# EAGLE board tester (EAGLE 9.6.2), part 1 of 2
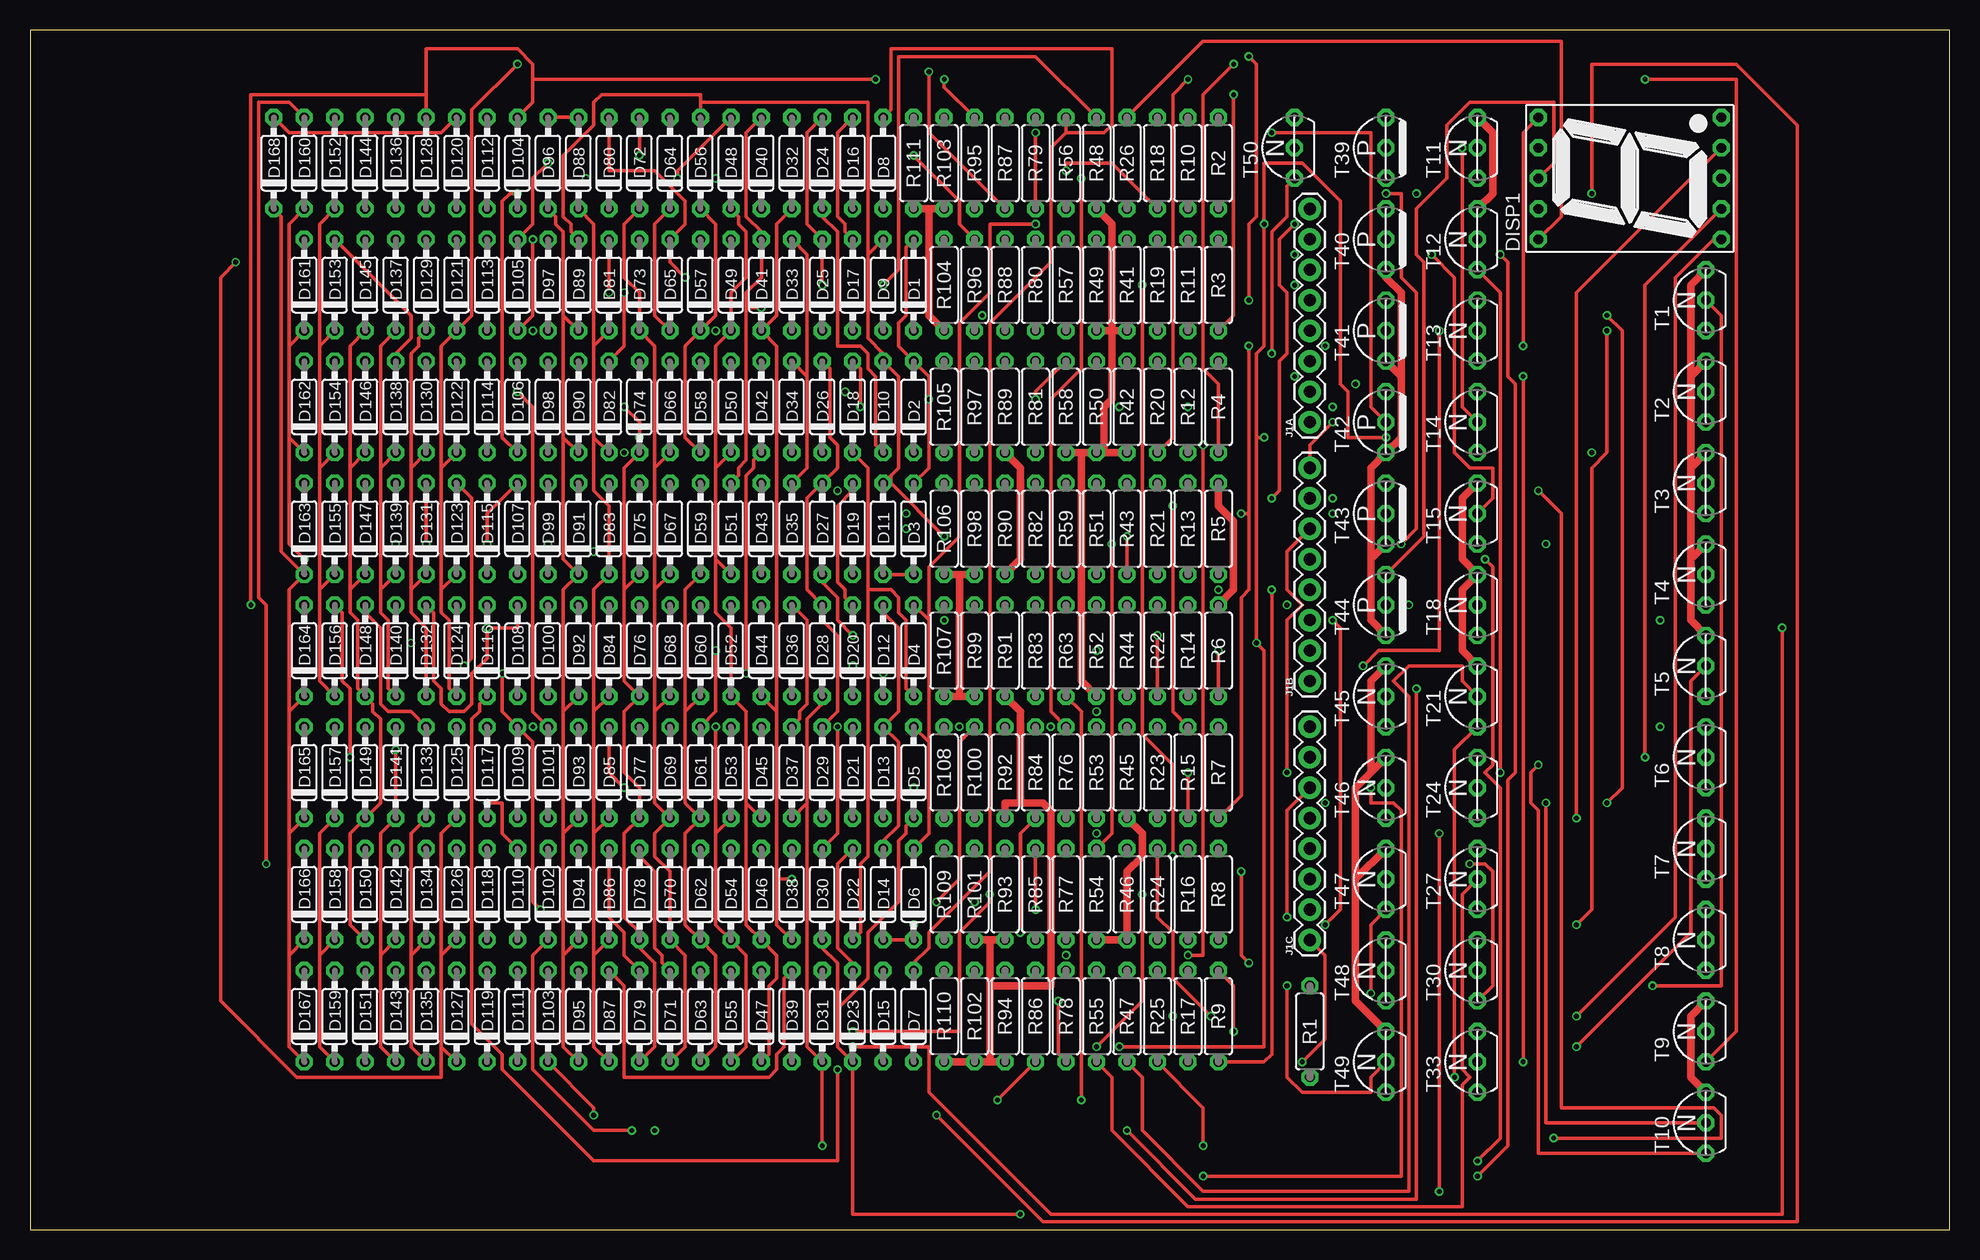
[diagram p1: board, top side]
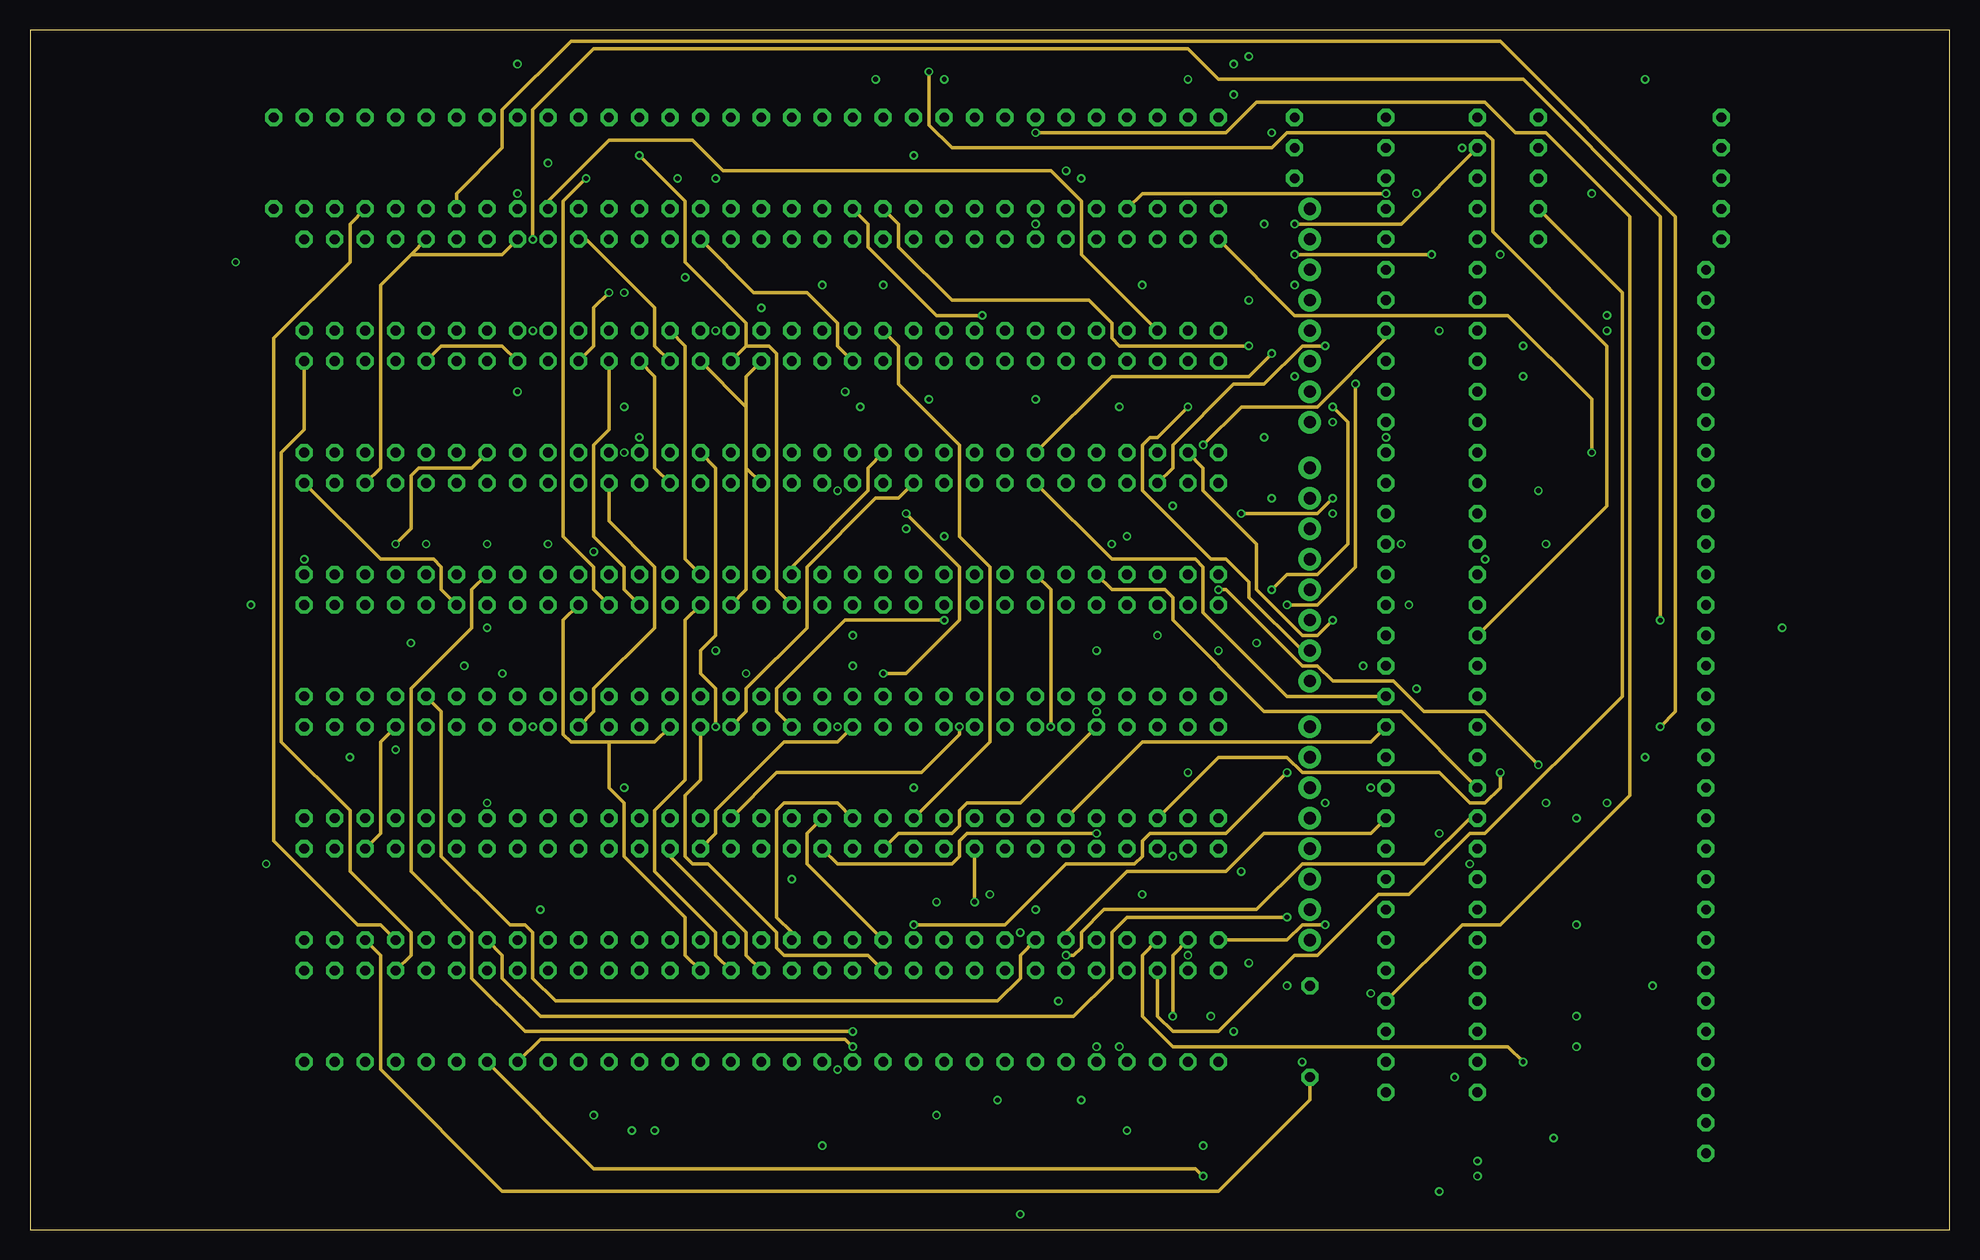
[diagram p2: board, inner layer Route2]
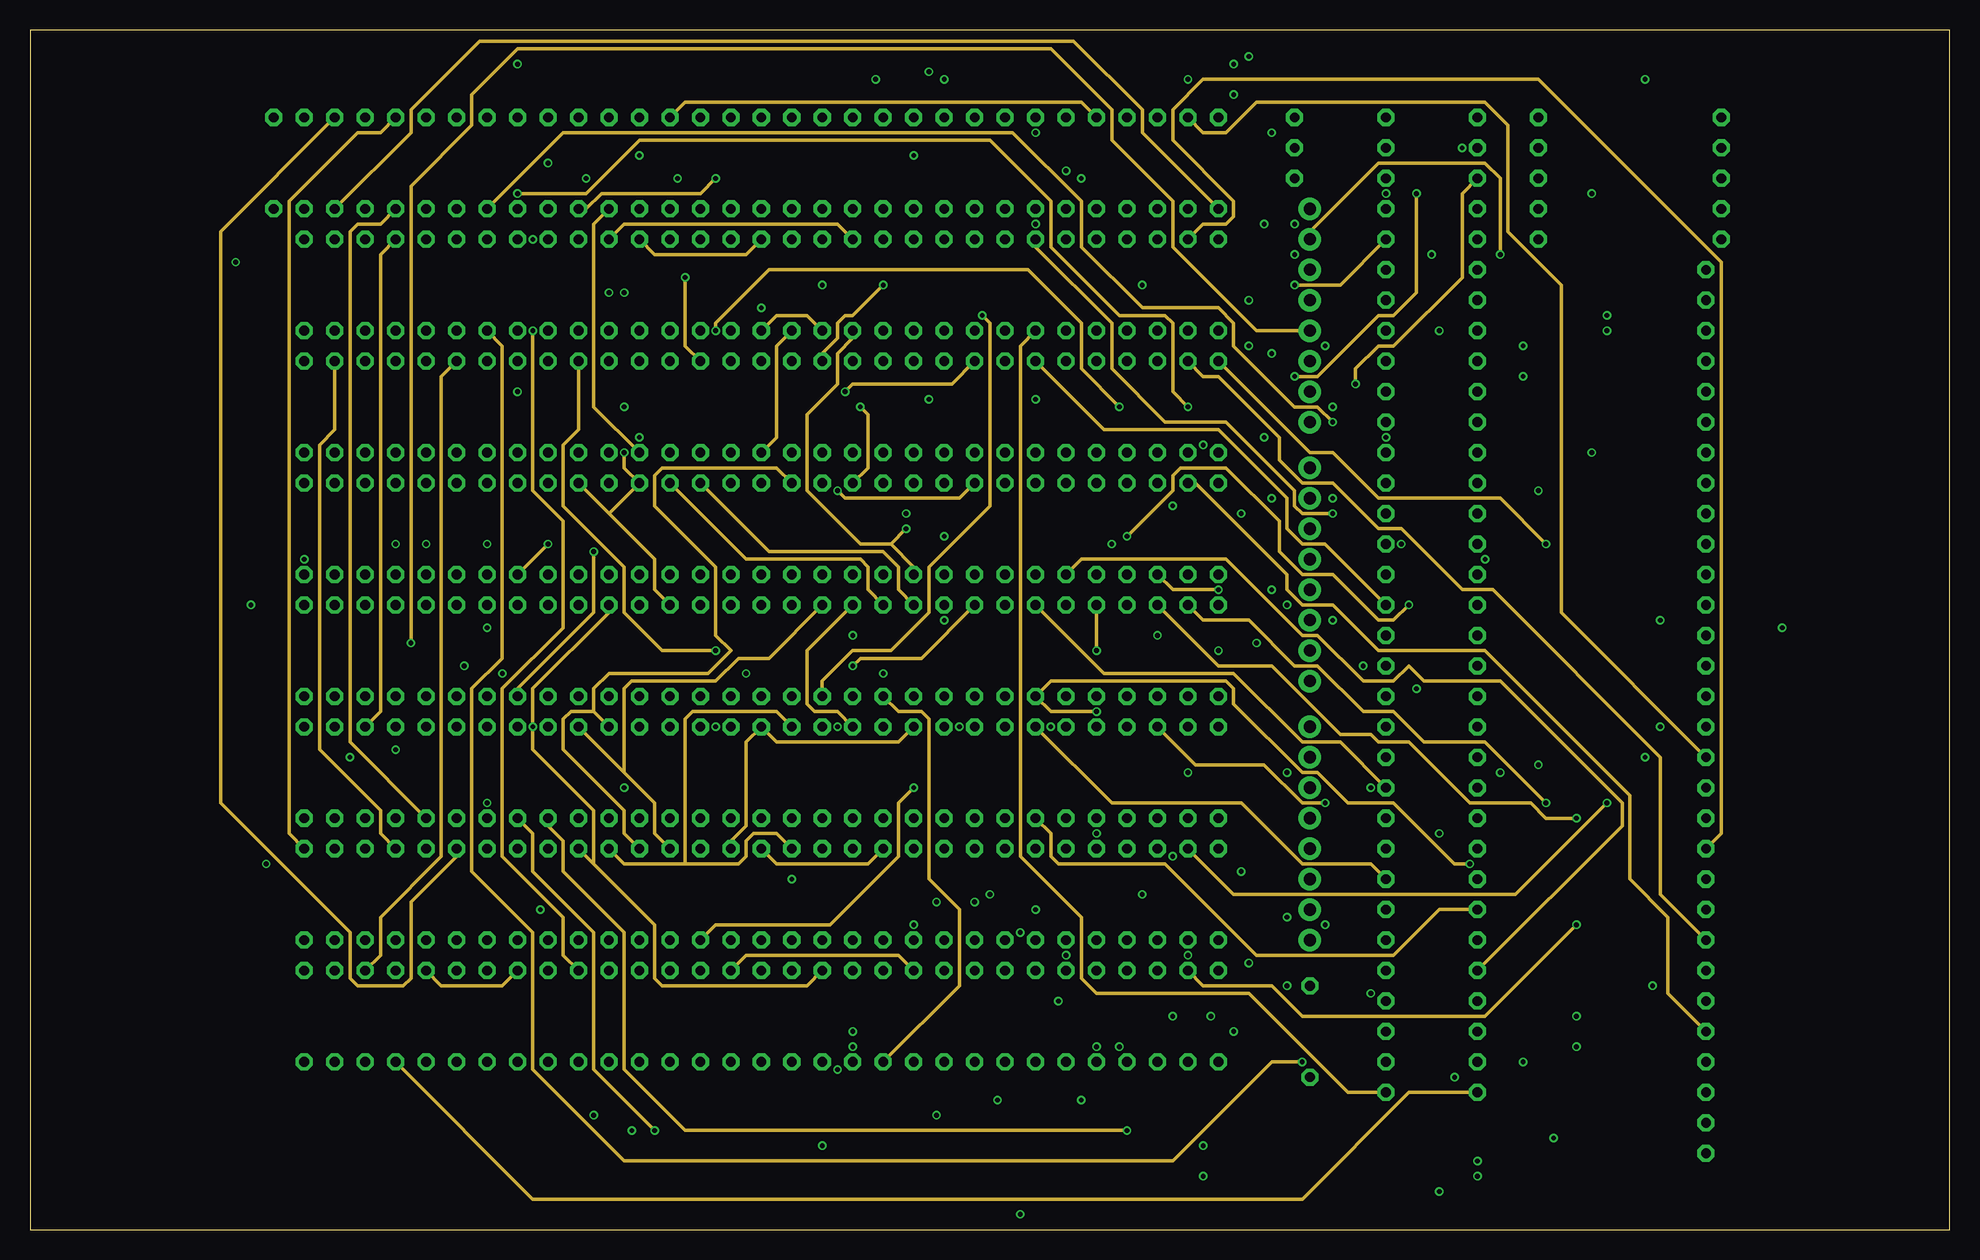
[diagram p3: board, inner layer Route15]
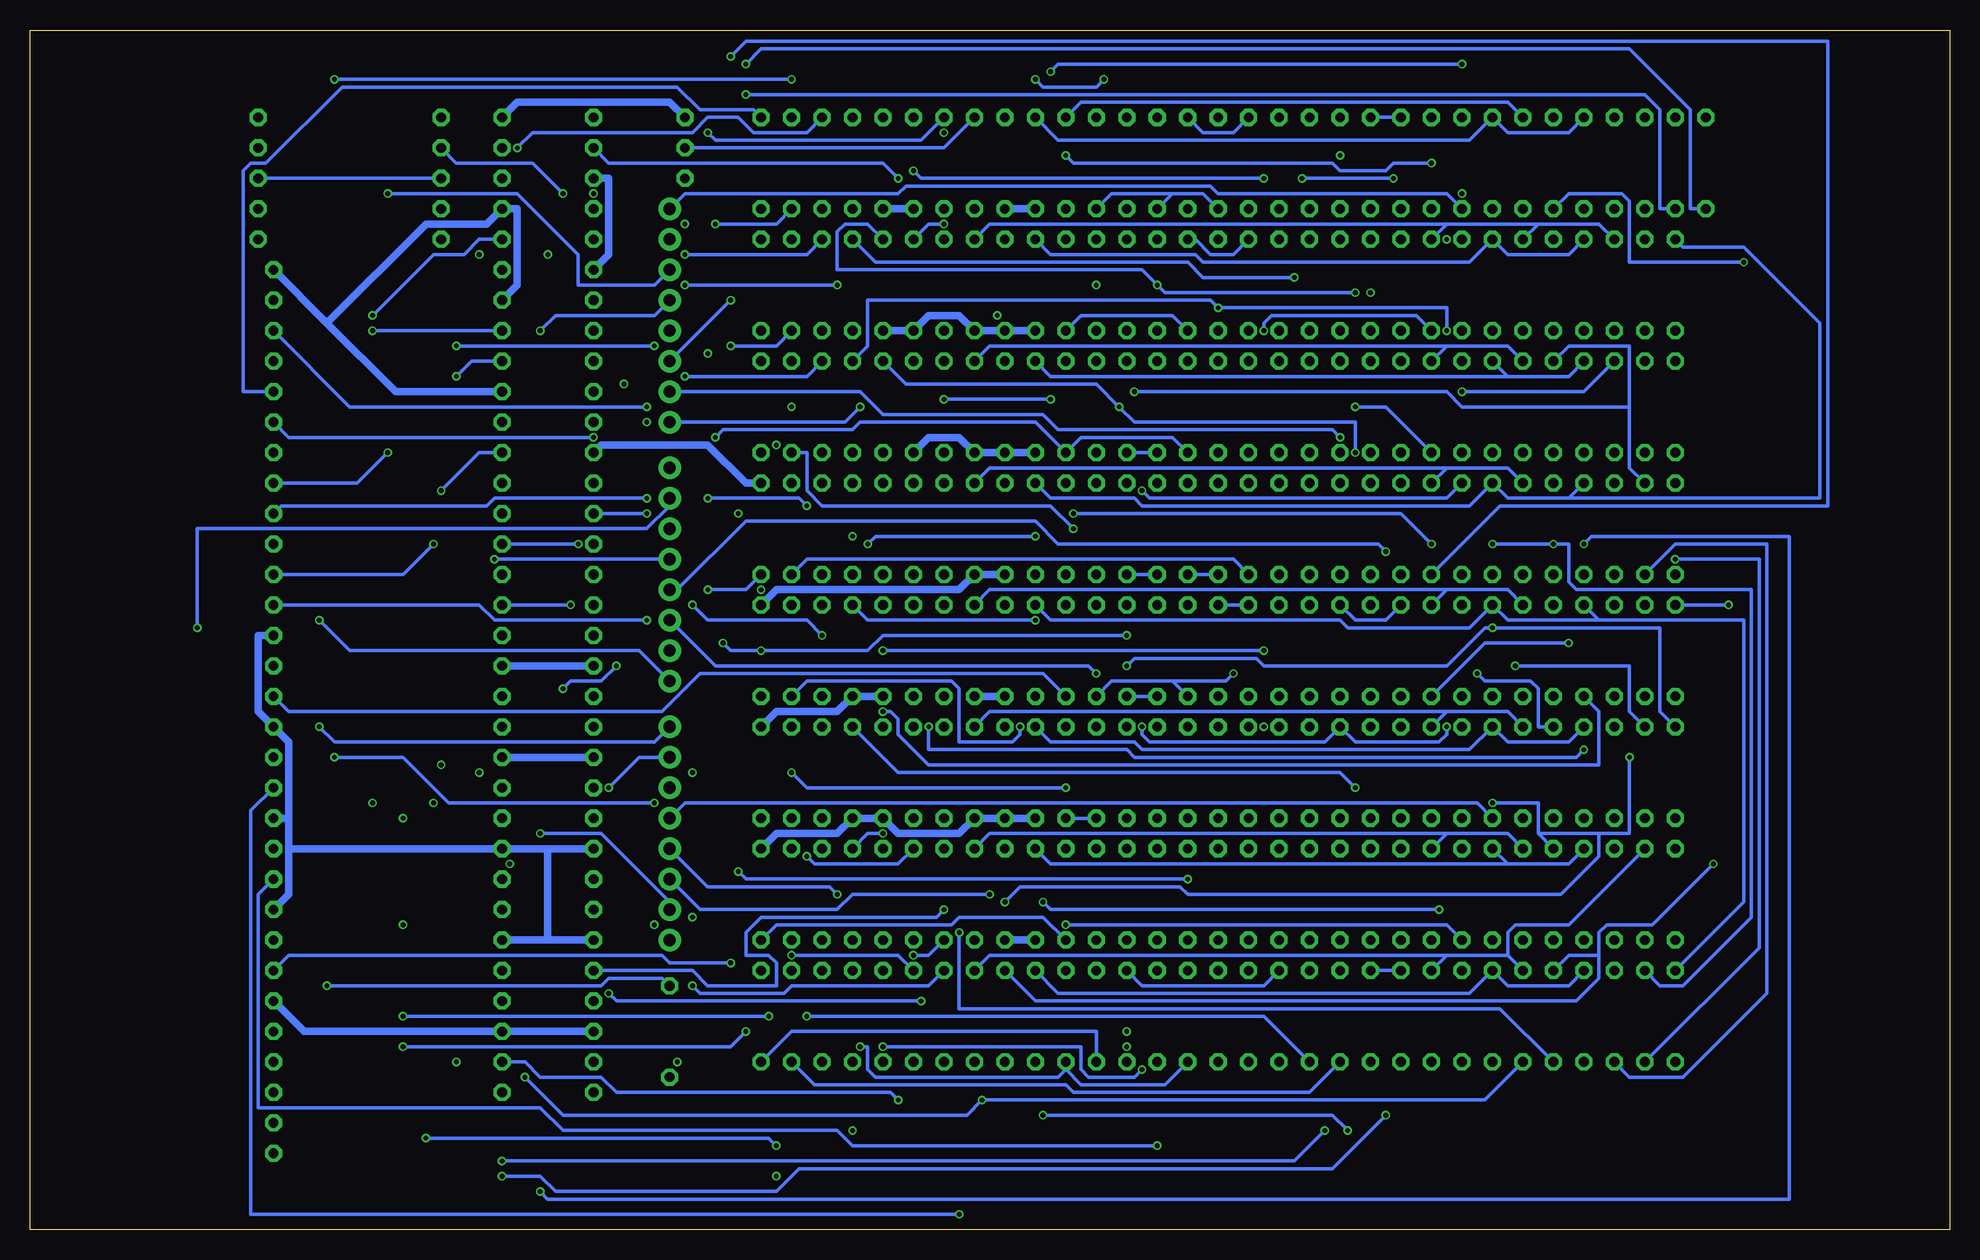
[diagram p4: board, bottom side, seen from below]

Size 160 x 100 mm. Coordinates in mm from the lower left corner, seen from the top.
Outline: 0,0 160,0 160,100 0,100 0,0
Copper layers (1*2*15*16): Top 0.035mm / dielectric 0.2mm / Route2 0.018mm / dielectric 1.5mm / Route15 0.018mm / dielectric 0.2mm / Bottom 0.035mm
Design rules "aisler_4_layer": minimum track width 0.1mm, minimum drill 0.2mm, track to track 0.1mm, track to pad 0.1mm, pad to pad 0.1mm, via to via 0.1mm, smd to smd 0.1mm, copper to edge 0.2mm, drill to drill 0.21mm, minimum pad ring 0.25mm, minimum via ring 0.15mm, stop-mask expansion 0mil, vias tented up to drill 0mil, thermal gap 10mil
Net classes: 0 default: width 0.305 mm, drill 0.4 mm, clearance 0.203 mm; 1 PWR: width 0.61 mm, drill 0.4 mm, clearance 0.203 mm

## Footprints (pad centres in the part's own frame; a part is rotated, then mirrored left to right if it is on the bottom)
DO35-7 = drill 0.813 pad 1.422 octagon: A 3.81,0; C -3.81,0
7SEG-13 = drill 0.813 pad 1.422 octagon: 1 -5.08,-7.62; 2 -2.54,-7.62; 3 0,-7.62; 4 2.54,-7.62; 5 5.08,-7.62; 6 5.08,7.62; 7 2.54,7.62; 8 0,7.62; 9 -2.54,7.62; 10 -5.08,7.62
1X08 = drill 1.016 pad 1.88: 1 0,0; 2 2.54,0; 3 5.08,0; 4 7.62,0; 5 10.16,0; 6 12.7,0; 7 15.24,0; 8 17.78,0
7MM_RESISTOR = drill 0.813 pad 1.422 octagon: 1 -3.81,0; 2 3.81,0
TO92-CBE = drill 0.813 pad 1.422 octagon: B 0,0; C -2.54,0; E 2.54,0
TO92-EBC = drill 0.813 pad 1.422 octagon: B 0,-1.27; C 2.54,-1.27; E -2.54,-1.27

## Placement (x,y rotation side)
D1  [DO35-7]  73.66,78.74 90 top
D2  [DO35-7]  73.66,68.58 90 top
D3  [DO35-7]  73.66,58.42 90 top
D4  [DO35-7]  73.66,48.26 90 top
D5  [DO35-7]  73.66,38.1 90 top
D6  [DO35-7]  73.66,27.94 90 top
D7  [DO35-7]  73.66,17.78 90 top
D8  [DO35-7]  71.12,88.9 90 top
D9  [DO35-7]  71.12,78.74 90 top
D10  [DO35-7]  71.12,68.58 90 top
D11  [DO35-7]  71.12,58.42 90 top
D12  [DO35-7]  71.12,48.26 90 top
D13  [DO35-7]  71.12,38.1 90 top
D14  [DO35-7]  71.12,27.94 90 top
D15  [DO35-7]  71.12,17.78 90 top
D16  [DO35-7]  68.58,88.9 90 top
D17  [DO35-7]  68.58,78.74 90 top
D18  [DO35-7]  68.58,68.58 90 top
D19  [DO35-7]  68.58,58.42 90 top
D20  [DO35-7]  68.58,48.26 90 top
D21  [DO35-7]  68.58,38.1 90 top
D22  [DO35-7]  68.58,27.94 90 top
D23  [DO35-7]  68.58,17.78 90 top
D24  [DO35-7]  66.04,88.9 90 top
D25  [DO35-7]  66.04,78.74 90 top
D26  [DO35-7]  66.04,68.58 90 top
D27  [DO35-7]  66.04,58.42 90 top
D28  [DO35-7]  66.04,48.26 90 top
D29  [DO35-7]  66.04,38.1 90 top
D30  [DO35-7]  66.04,27.94 90 top
D31  [DO35-7]  66.04,17.78 90 top
D32  [DO35-7]  63.5,88.9 90 top
D33  [DO35-7]  63.5,78.74 90 top
D34  [DO35-7]  63.5,68.58 90 top
D35  [DO35-7]  63.5,58.42 90 top
D36  [DO35-7]  63.5,48.26 90 top
D37  [DO35-7]  63.5,38.1 90 top
D38  [DO35-7]  63.5,27.94 90 top
D39  [DO35-7]  63.5,17.78 90 top
D40  [DO35-7]  60.96,88.9 90 top
D41  [DO35-7]  60.96,78.74 90 top
D42  [DO35-7]  60.96,68.58 90 top
D43  [DO35-7]  60.96,58.42 90 top
D44  [DO35-7]  60.96,48.26 90 top
D45  [DO35-7]  60.96,38.1 90 top
D46  [DO35-7]  60.96,27.94 90 top
D47  [DO35-7]  60.96,17.78 90 top
D48  [DO35-7]  58.42,88.9 90 top
D49  [DO35-7]  58.42,78.74 90 top
D50  [DO35-7]  58.42,68.58 90 top
D51  [DO35-7]  58.42,58.42 90 top
D52  [DO35-7]  58.42,48.26 90 top
D53  [DO35-7]  58.42,38.1 90 top
D54  [DO35-7]  58.42,27.94 90 top
D55  [DO35-7]  58.42,17.78 90 top
D56  [DO35-7]  55.88,88.9 90 top
D57  [DO35-7]  55.88,78.74 90 top
D58  [DO35-7]  55.88,68.58 90 top
D59  [DO35-7]  55.88,58.42 90 top
D60  [DO35-7]  55.88,48.26 90 top
D61  [DO35-7]  55.88,38.1 90 top
D62  [DO35-7]  55.88,27.94 90 top
D63  [DO35-7]  55.88,17.78 90 top
D64  [DO35-7]  53.34,88.9 90 top
D65  [DO35-7]  53.34,78.74 90 top
D66  [DO35-7]  53.34,68.58 90 top
D67  [DO35-7]  53.34,58.42 90 top
D68  [DO35-7]  53.34,48.26 90 top
D69  [DO35-7]  53.34,38.1 90 top
D70  [DO35-7]  53.34,27.94 90 top
D71  [DO35-7]  53.34,17.78 90 top
D72  [DO35-7]  50.8,88.9 90 top
D73  [DO35-7]  50.8,78.74 90 top
D74  [DO35-7]  50.8,68.58 90 top
D75  [DO35-7]  50.8,58.42 90 top
D76  [DO35-7]  50.8,48.26 90 top
D77  [DO35-7]  50.8,38.1 90 top
D78  [DO35-7]  50.8,27.94 90 top
D79  [DO35-7]  50.8,17.78 90 top
D80  [DO35-7]  48.26,88.9 90 top
D81  [DO35-7]  48.26,78.74 90 top
D82  [DO35-7]  48.26,68.58 90 top
D83  [DO35-7]  48.26,58.42 90 top
D84  [DO35-7]  48.26,48.26 90 top
D85  [DO35-7]  48.26,38.1 90 top
D86  [DO35-7]  48.26,27.94 90 top
D87  [DO35-7]  48.26,17.78 90 top
D88  [DO35-7]  45.72,88.9 90 top
D89  [DO35-7]  45.72,78.74 90 top
D90  [DO35-7]  45.72,68.58 90 top
D91  [DO35-7]  45.72,58.42 90 top
D92  [DO35-7]  45.72,48.26 90 top
D93  [DO35-7]  45.72,38.1 90 top
D94  [DO35-7]  45.72,27.94 90 top
D95  [DO35-7]  45.72,17.78 90 top
D96  [DO35-7]  43.18,88.9 90 top
D97  [DO35-7]  43.18,78.74 90 top
D98  [DO35-7]  43.18,68.58 90 top
D99  [DO35-7]  43.18,58.42 90 top
D100  [DO35-7]  43.18,48.26 90 top
D101  [DO35-7]  43.18,38.1 90 top
D102  [DO35-7]  43.18,27.94 90 top
D103  [DO35-7]  43.18,17.78 90 top
D104  [DO35-7]  40.64,88.9 90 top
D105  [DO35-7]  40.64,78.74 90 top
D106  [DO35-7]  40.64,68.58 90 top
D107  [DO35-7]  40.64,58.42 90 top
D108  [DO35-7]  40.64,48.26 90 top
D109  [DO35-7]  40.64,38.1 90 top
D110  [DO35-7]  40.64,27.94 90 top
D111  [DO35-7]  40.64,17.78 90 top
D112  [DO35-7]  38.1,88.9 90 top
D113  [DO35-7]  38.1,78.74 90 top
D114  [DO35-7]  38.1,68.58 90 top
D115  [DO35-7]  38.1,58.42 90 top
D116  [DO35-7]  38.1,48.26 90 top
D117  [DO35-7]  38.1,38.1 90 top
D118  [DO35-7]  38.1,27.94 90 top
D119  [DO35-7]  38.1,17.78 90 top
D120  [DO35-7]  35.56,88.9 90 top
D121  [DO35-7]  35.56,78.74 90 top
D122  [DO35-7]  35.56,68.58 90 top
D123  [DO35-7]  35.56,58.42 90 top
D124  [DO35-7]  35.56,48.26 90 top
D125  [DO35-7]  35.56,38.1 90 top
D126  [DO35-7]  35.56,27.94 90 top
D127  [DO35-7]  35.56,17.78 90 top
D128  [DO35-7]  33.02,88.9 90 top
D129  [DO35-7]  33.02,78.74 90 top
D130  [DO35-7]  33.02,68.58 90 top
D131  [DO35-7]  33.02,58.42 90 top
D132  [DO35-7]  33.02,48.26 90 top
D133  [DO35-7]  33.02,38.1 90 top
D134  [DO35-7]  33.02,27.94 90 top
D135  [DO35-7]  33.02,17.78 90 top
D136  [DO35-7]  30.48,88.9 90 top
D137  [DO35-7]  30.48,78.74 90 top
D138  [DO35-7]  30.48,68.58 90 top
D139  [DO35-7]  30.48,58.42 90 top
D140  [DO35-7]  30.48,48.26 90 top
D141  [DO35-7]  30.48,38.1 90 top
D142  [DO35-7]  30.48,27.94 90 top
D143  [DO35-7]  30.48,17.78 90 top
D144  [DO35-7]  27.94,88.9 90 top
D145  [DO35-7]  27.94,78.74 90 top
D146  [DO35-7]  27.94,68.58 90 top
D147  [DO35-7]  27.94,58.42 90 top
D148  [DO35-7]  27.94,48.26 90 top
D149  [DO35-7]  27.94,38.1 90 top
D150  [DO35-7]  27.94,27.94 90 top
D151  [DO35-7]  27.94,17.78 90 top
D152  [DO35-7]  25.4,88.9 90 top
D153  [DO35-7]  25.4,78.74 90 top
D154  [DO35-7]  25.4,68.58 90 top
D155  [DO35-7]  25.4,58.42 90 top
D156  [DO35-7]  25.4,48.26 90 top
D157  [DO35-7]  25.4,38.1 90 top
D158  [DO35-7]  25.4,27.94 90 top
D159  [DO35-7]  25.4,17.78 90 top
D160  [DO35-7]  22.86,88.9 90 top
D161  [DO35-7]  22.86,78.74 90 top
D162  [DO35-7]  22.86,68.58 90 top
D163  [DO35-7]  22.86,58.42 90 top
D164  [DO35-7]  22.86,48.26 90 top
D165  [DO35-7]  22.86,38.1 90 top
D166  [DO35-7]  22.86,27.94 90 top
D167  [DO35-7]  22.86,17.78 90 top
D168  [DO35-7]  20.32,88.9 90 top
DISP1  [7SEG-13]  133.35,87.63 90 top
J1A  [1X08]  106.68,67.31 90 top
J1B  [1X08]  106.68,45.72 90 top
J1C  [1X08]  106.68,24.13 90 top
R1  [7MM_RESISTOR]  106.68,16.51 90 top
R2  [7MM_RESISTOR]  99.06,88.9 90 top
R3  [7MM_RESISTOR]  99.06,78.74 90 top
R4  [7MM_RESISTOR]  99.06,68.58 90 top
R5  [7MM_RESISTOR]  99.06,58.42 90 top
R6  [7MM_RESISTOR]  99.06,48.26 90 top
R7  [7MM_RESISTOR]  99.06,38.1 90 top
R8  [7MM_RESISTOR]  99.06,27.94 90 top
R9  [7MM_RESISTOR]  99.06,17.78 90 top
R10  [7MM_RESISTOR]  96.52,88.9 90 top
R11  [7MM_RESISTOR]  96.52,78.74 90 top
R12  [7MM_RESISTOR]  96.52,68.58 90 top
R13  [7MM_RESISTOR]  96.52,58.42 90 top
R14  [7MM_RESISTOR]  96.52,48.26 90 top
R15  [7MM_RESISTOR]  96.52,38.1 90 top
R16  [7MM_RESISTOR]  96.52,27.94 90 top
R17  [7MM_RESISTOR]  96.52,17.78 90 top
R18  [7MM_RESISTOR]  93.98,88.9 90 top
R19  [7MM_RESISTOR]  93.98,78.74 90 top
R20  [7MM_RESISTOR]  93.98,68.58 90 top
R21  [7MM_RESISTOR]  93.98,58.42 90 top
R22  [7MM_RESISTOR]  93.98,48.26 90 top
R23  [7MM_RESISTOR]  93.98,38.1 90 top
R24  [7MM_RESISTOR]  93.98,27.94 90 top
R25  [7MM_RESISTOR]  93.98,17.78 90 top
R26  [7MM_RESISTOR]  91.44,88.9 90 top
R41  [7MM_RESISTOR]  91.44,78.74 90 top
R42  [7MM_RESISTOR]  91.44,68.58 90 top
R43  [7MM_RESISTOR]  91.44,58.42 90 top
R44  [7MM_RESISTOR]  91.44,48.26 90 top
R45  [7MM_RESISTOR]  91.44,38.1 90 top
R46  [7MM_RESISTOR]  91.44,27.94 90 top
R47  [7MM_RESISTOR]  91.44,17.78 90 top
R48  [7MM_RESISTOR]  88.9,88.9 90 top
R49  [7MM_RESISTOR]  88.9,78.74 90 top
R50  [7MM_RESISTOR]  88.9,68.58 90 top
R51  [7MM_RESISTOR]  88.9,58.42 90 top
R52  [7MM_RESISTOR]  88.9,48.26 90 top
R53  [7MM_RESISTOR]  88.9,38.1 90 top
R54  [7MM_RESISTOR]  88.9,27.94 90 top
R55  [7MM_RESISTOR]  88.9,17.78 90 top
R56  [7MM_RESISTOR]  86.36,88.9 90 top
R57  [7MM_RESISTOR]  86.36,78.74 90 top
R58  [7MM_RESISTOR]  86.36,68.58 90 top
R59  [7MM_RESISTOR]  86.36,58.42 90 top
R63  [7MM_RESISTOR]  86.36,48.26 90 top
R76  [7MM_RESISTOR]  86.36,38.1 90 top
R77  [7MM_RESISTOR]  86.36,27.94 90 top
R78  [7MM_RESISTOR]  86.36,17.78 90 top
R79  [7MM_RESISTOR]  83.82,88.9 90 top
R80  [7MM_RESISTOR]  83.82,78.74 90 top
R81  [7MM_RESISTOR]  83.82,68.58 90 top
R82  [7MM_RESISTOR]  83.82,58.42 90 top
R83  [7MM_RESISTOR]  83.82,48.26 90 top
R84  [7MM_RESISTOR]  83.82,38.1 90 top
R85  [7MM_RESISTOR]  83.82,27.94 90 top
R86  [7MM_RESISTOR]  83.82,17.78 90 top
R87  [7MM_RESISTOR]  81.28,88.9 90 top
R88  [7MM_RESISTOR]  81.28,78.74 90 top
R89  [7MM_RESISTOR]  81.28,68.58 90 top
R90  [7MM_RESISTOR]  81.28,58.42 90 top
R91  [7MM_RESISTOR]  81.28,48.26 90 top
R92  [7MM_RESISTOR]  81.28,38.1 90 top
R93  [7MM_RESISTOR]  81.28,27.94 90 top
R94  [7MM_RESISTOR]  81.28,17.78 90 top
R95  [7MM_RESISTOR]  78.74,88.9 90 top
R96  [7MM_RESISTOR]  78.74,78.74 90 top
R97  [7MM_RESISTOR]  78.74,68.58 90 top
R98  [7MM_RESISTOR]  78.74,58.42 90 top
R99  [7MM_RESISTOR]  78.74,48.26 90 top
R100  [7MM_RESISTOR]  78.74,38.1 90 top
R101  [7MM_RESISTOR]  78.74,27.94 90 top
R102  [7MM_RESISTOR]  78.74,17.78 90 top
R103  [7MM_RESISTOR]  76.2,88.9 90 top
R104  [7MM_RESISTOR]  76.2,78.74 90 top
R105  [7MM_RESISTOR]  76.2,68.58 90 top
R106  [7MM_RESISTOR]  76.2,58.42 90 top
R107  [7MM_RESISTOR]  76.2,48.26 90 top
R108  [7MM_RESISTOR]  76.2,38.1 90 top
R109  [7MM_RESISTOR]  76.2,27.94 90 top
R110  [7MM_RESISTOR]  76.2,17.78 90 top
R111  [7MM_RESISTOR]  73.66,88.9 90 top
T1  [TO92-CBE]  139.7,77.47 90 top
T2  [TO92-CBE]  139.7,69.85 90 top
T3  [TO92-CBE]  139.7,62.23 90 top
T4  [TO92-CBE]  139.7,54.61 90 top
T5  [TO92-CBE]  139.7,46.99 90 top
T6  [TO92-CBE]  139.7,39.37 90 top
T7  [TO92-CBE]  139.7,31.75 90 top
T8  [TO92-CBE]  139.7,24.13 90 top
T9  [TO92-CBE]  139.7,16.51 90 top
T10  [TO92-CBE]  139.7,8.89 90 top
T11  [TO92-CBE]  120.65,90.17 90 top
T12  [TO92-CBE]  120.65,82.55 90 top
T13  [TO92-CBE]  120.65,74.93 90 top
T14  [TO92-CBE]  120.65,67.31 90 top
T15  [TO92-CBE]  120.65,59.69 90 top
T18  [TO92-CBE]  120.65,52.07 90 top
T21  [TO92-CBE]  120.65,44.45 90 top
T24  [TO92-CBE]  120.65,36.83 90 top
T27  [TO92-CBE]  120.65,29.21 90 top
T30  [TO92-CBE]  120.65,21.59 90 top
T33  [TO92-CBE]  120.65,13.97 90 top
T39  [TO92-EBC]  111.76,90.17 90 top
T40  [TO92-EBC]  111.76,82.55 90 top
T41  [TO92-EBC]  111.76,74.93 90 top
T42  [TO92-EBC]  111.76,67.31 90 top
T43  [TO92-EBC]  111.76,59.69 90 top
T44  [TO92-EBC]  111.76,52.07 90 top
T45  [TO92-CBE]  113.03,44.45 90 top
T46  [TO92-CBE]  113.03,36.83 90 top
T47  [TO92-CBE]  113.03,29.21 90 top
T48  [TO92-CBE]  113.03,21.59 90 top
T49  [TO92-CBE]  113.03,13.97 90 top
T50  [TO92-CBE]  105.41,90.17 90 top